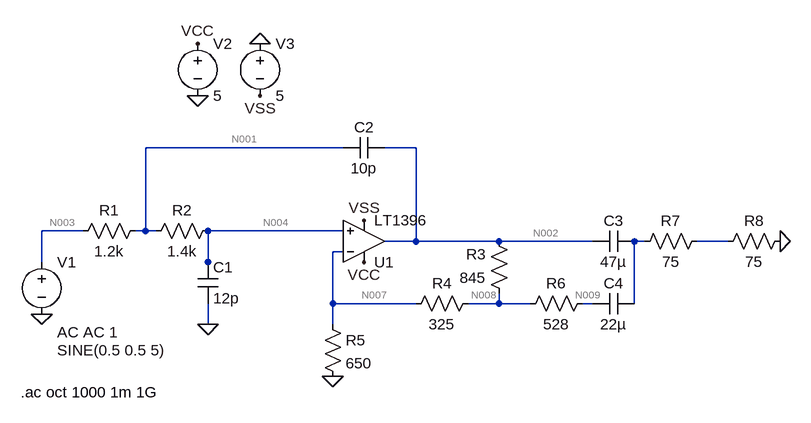
[diagram p0: schematic video_amp.asc]
video_amp.asc, the LTspice schematic file:
Version 4
SHEET 1 932 680
WIRE 240 32 -64 32
WIRE 352 32 304 32
WIRE -160 160 -224 160
WIRE -64 160 -64 32
WIRE -64 160 -80 160
WIRE -48 160 -64 160
WIRE 240 160 32 160
WIRE 352 176 352 32
WIRE 352 176 304 176
WIRE 480 176 352 176
WIRE 624 176 480 176
WIRE 704 176 688 176
WIRE 832 176 784 176
WIRE 240 192 224 192
WIRE -224 208 -224 160
WIRE 32 208 32 160
WIRE 32 224 32 208
WIRE 224 272 224 192
WIRE 352 272 224 272
WIRE 480 272 480 256
WIRE 480 272 432 272
WIRE 528 272 480 272
WIRE 624 272 608 272
WIRE 688 272 688 176
WIRE 32 304 32 272
WIRE 224 304 224 272
FLAG -224 288 0
FLAG 32 304 0
FLAG 224 384 0
FLAG 16 -48 0
FLAG 112 -128 0
FLAG 16 -128 VCC
FLAG 112 -48 VSS
FLAG 272 208 VCC
FLAG 272 144 VSS
FLAG 912 176 0
SYMBOL Opamps\\LT1396 272 240 M180
SYMATTR InstName U1
SYMBOL voltage -224 192 R0
WINDOW 3 24 152 Left 2
WINDOW 123 24 124 Left 2
WINDOW 39 0 0 Left 2
SYMATTR Value SINE(0.5 0.5 5)
SYMATTR Value2 AC AC 1
SYMATTR InstName V1
SYMBOL res -64 144 R90
WINDOW 0 0 56 VBottom 2
WINDOW 3 32 56 VTop 2
SYMATTR InstName R1
SYMATTR Value 1.2k
SYMBOL res 48 144 R90
WINDOW 0 0 56 VBottom 2
WINDOW 3 32 56 VTop 2
SYMATTR InstName R2
SYMATTR Value 1.4k
SYMBOL cap 16 208 R0
SYMATTR InstName C1
SYMATTR Value 12p
SYMBOL cap 304 16 R90
WINDOW 0 0 32 VBottom 2
WINDOW 3 32 32 VTop 2
SYMATTR InstName C2
SYMATTR Value 10p
SYMBOL res 496 272 R180
WINDOW 0 36 76 Left 2
WINDOW 3 36 40 Left 2
SYMATTR InstName R3
SYMATTR Value 845
SYMBOL res 336 288 R270
WINDOW 0 32 56 VTop 2
WINDOW 3 0 56 VBottom 2
SYMATTR InstName R4
SYMATTR Value 325
SYMBOL res 208 288 R0
SYMATTR InstName R5
SYMATTR Value 650
SYMBOL res 512 288 R270
WINDOW 0 32 56 VTop 2
WINDOW 3 0 56 VBottom 2
SYMATTR InstName R6
SYMATTR Value 528
SYMBOL voltage 16 -144 R0
WINDOW 123 0 0 Left 2
WINDOW 39 0 0 Left 2
SYMATTR InstName V2
SYMATTR Value 5
SYMBOL voltage 112 -144 R0
WINDOW 123 0 0 Left 2
WINDOW 39 0 0 Left 2
SYMATTR InstName V3
SYMATTR Value 5
SYMBOL res 800 160 R90
WINDOW 0 0 56 VBottom 2
WINDOW 3 32 56 VTop 2
SYMATTR InstName R7
SYMATTR Value 75
SYMBOL cap 688 160 R90
WINDOW 0 0 32 VBottom 2
WINDOW 3 32 32 VTop 2
SYMATTR InstName C3
SYMATTR Value 47µ
SYMATTR SpiceLine V=4 Irms=16.4 Rser=0.00218555 Lser=0
SYMBOL cap 688 256 R90
WINDOW 0 0 32 VBottom 2
WINDOW 3 32 32 VTop 2
SYMATTR InstName C4
SYMATTR Value 22µ
SYMATTR SpiceLine V=4 Irms=14.4 Rser=0.00217802 Lser=0
SYMBOL res 928 160 R90
WINDOW 0 0 56 VBottom 2
WINDOW 3 32 56 VTop 2
SYMATTR InstName R8
SYMATTR Value 75
TEXT -256 408 Left 2 !.ac oct 1000 1m 1G

The netlist it stands for:
* video_amp.asc
XU1 N004 N007 VCC VSS N002 LT1396  ; pins In+ In- V+ V- OUT
V1 N003 0 SINE(0.5 0.5 5) AC AC 1
R1 N001 N003 1.2k
R2 N004 N001 1.4k
C1 N004 0 12p
C2 N002 N001 10p
R3 N008 N002 845
R4 N007 N008 325
R5 N007 0 650
R6 N008 N009 528
V2 VCC 0 5
V3 0 VSS 5
R7 N006 N005 75
C3 N005 N002 47µ V=4 Irms=16.4 Rser=0.00218555 Lser=0
C4 N005 N009 22µ V=4 Irms=14.4 Rser=0.00217802 Lser=0
R8 0 N006 75
.ac oct 1000 1m 1G
.backanno
.end

* Results of the author's LTspice run, read from the files saved beside the schematic
* Operating Point, zero values left out:
*   V(n007) = 499.2 mV
*   V(vcc) = 5 V
*   V(n002) = 1.385 V
*   V(vss) = -5 V
*   V(n004) = 499.7 mV
*   V(n003) = 500 mV
*   V(n001) = 499.9 mV
*   V(n008) = 745.4 mV
*   V(n009) = 745.4 mV
*   I(R5) = 767.9 µA
*   I(R4) = -757.6 µA
*   I(R3) = -757.6 µA
*   I(R2) = -102.6 nA
*   I(R1) = -102.6 nA
*   I(V3) = -4.79 mA
*   I(V2) = -5.557 mA
*   I(V1) = -102.6 nA
*   Ix(u1:1) = 102.6 nA
*   Ix(u1:2) = -10.36 µA
*   Ix(u1:3) = 5.557 mA
*   Ix(u1:4) = -4.79 mA
*   Ix(u1:5) = -757.6 µA